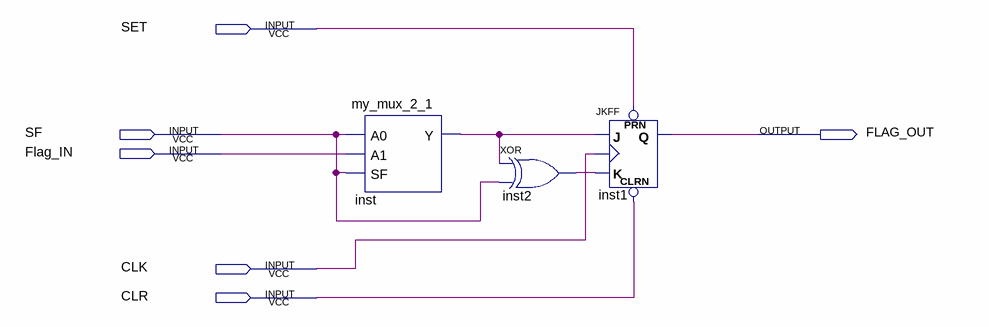
[diagram p0: schematic sheet]
// Quartus schematic Flag_Reg.bdf as structural Verilog: 3 symbols, 6 pins
module Flag_Reg (
  input  SET,
  input  SF,
  input  Flag_IN,
  input  CLK,
  input  CLR,
  output FLAG_OUT
);

  wire inst2_out, inst_y;

  my_mux_2_1 inst (.A0(SF), .A1(Flag_IN), .SF(SF), .Y(inst_y));
  xor inst2 (inst2_out, inst_y, SF);
  JKFF inst1 (.PRN(SET), .CLRN(CLR), .K(inst2_out), .J(inst_y), .CLK(CLK), .Q(FLAG_OUT));
endmodule
